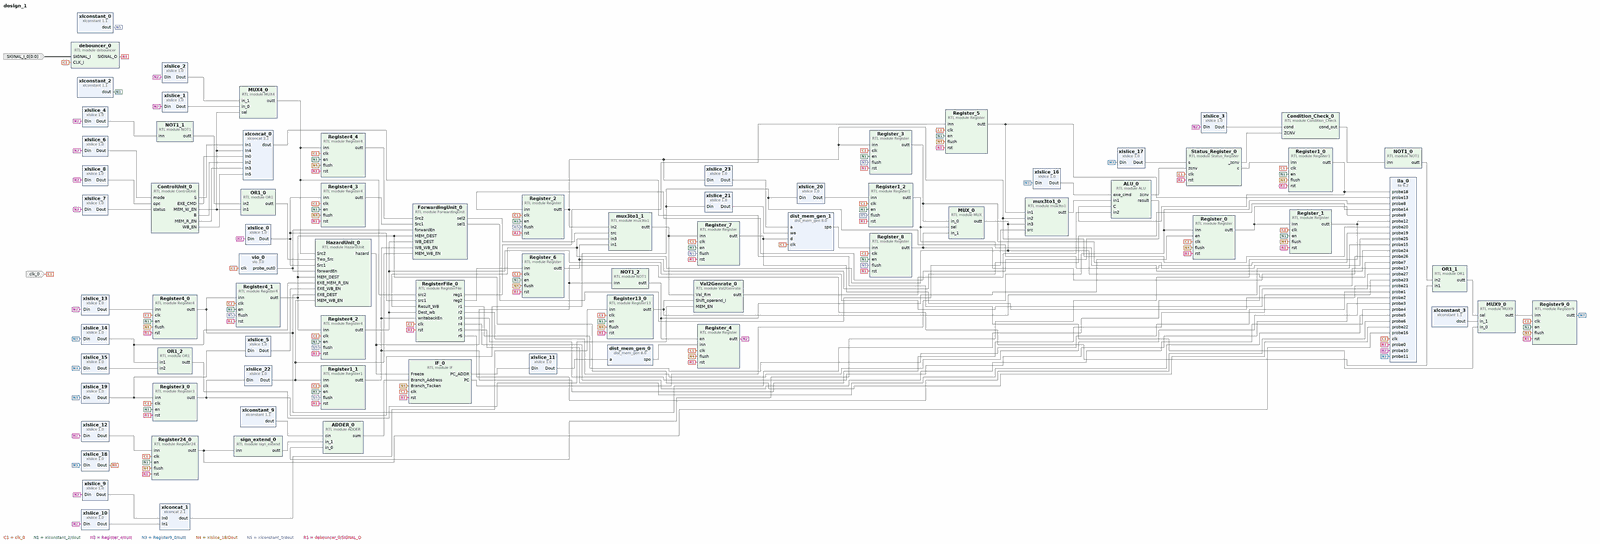
[diagram p0: block diagram of the top level, whole]
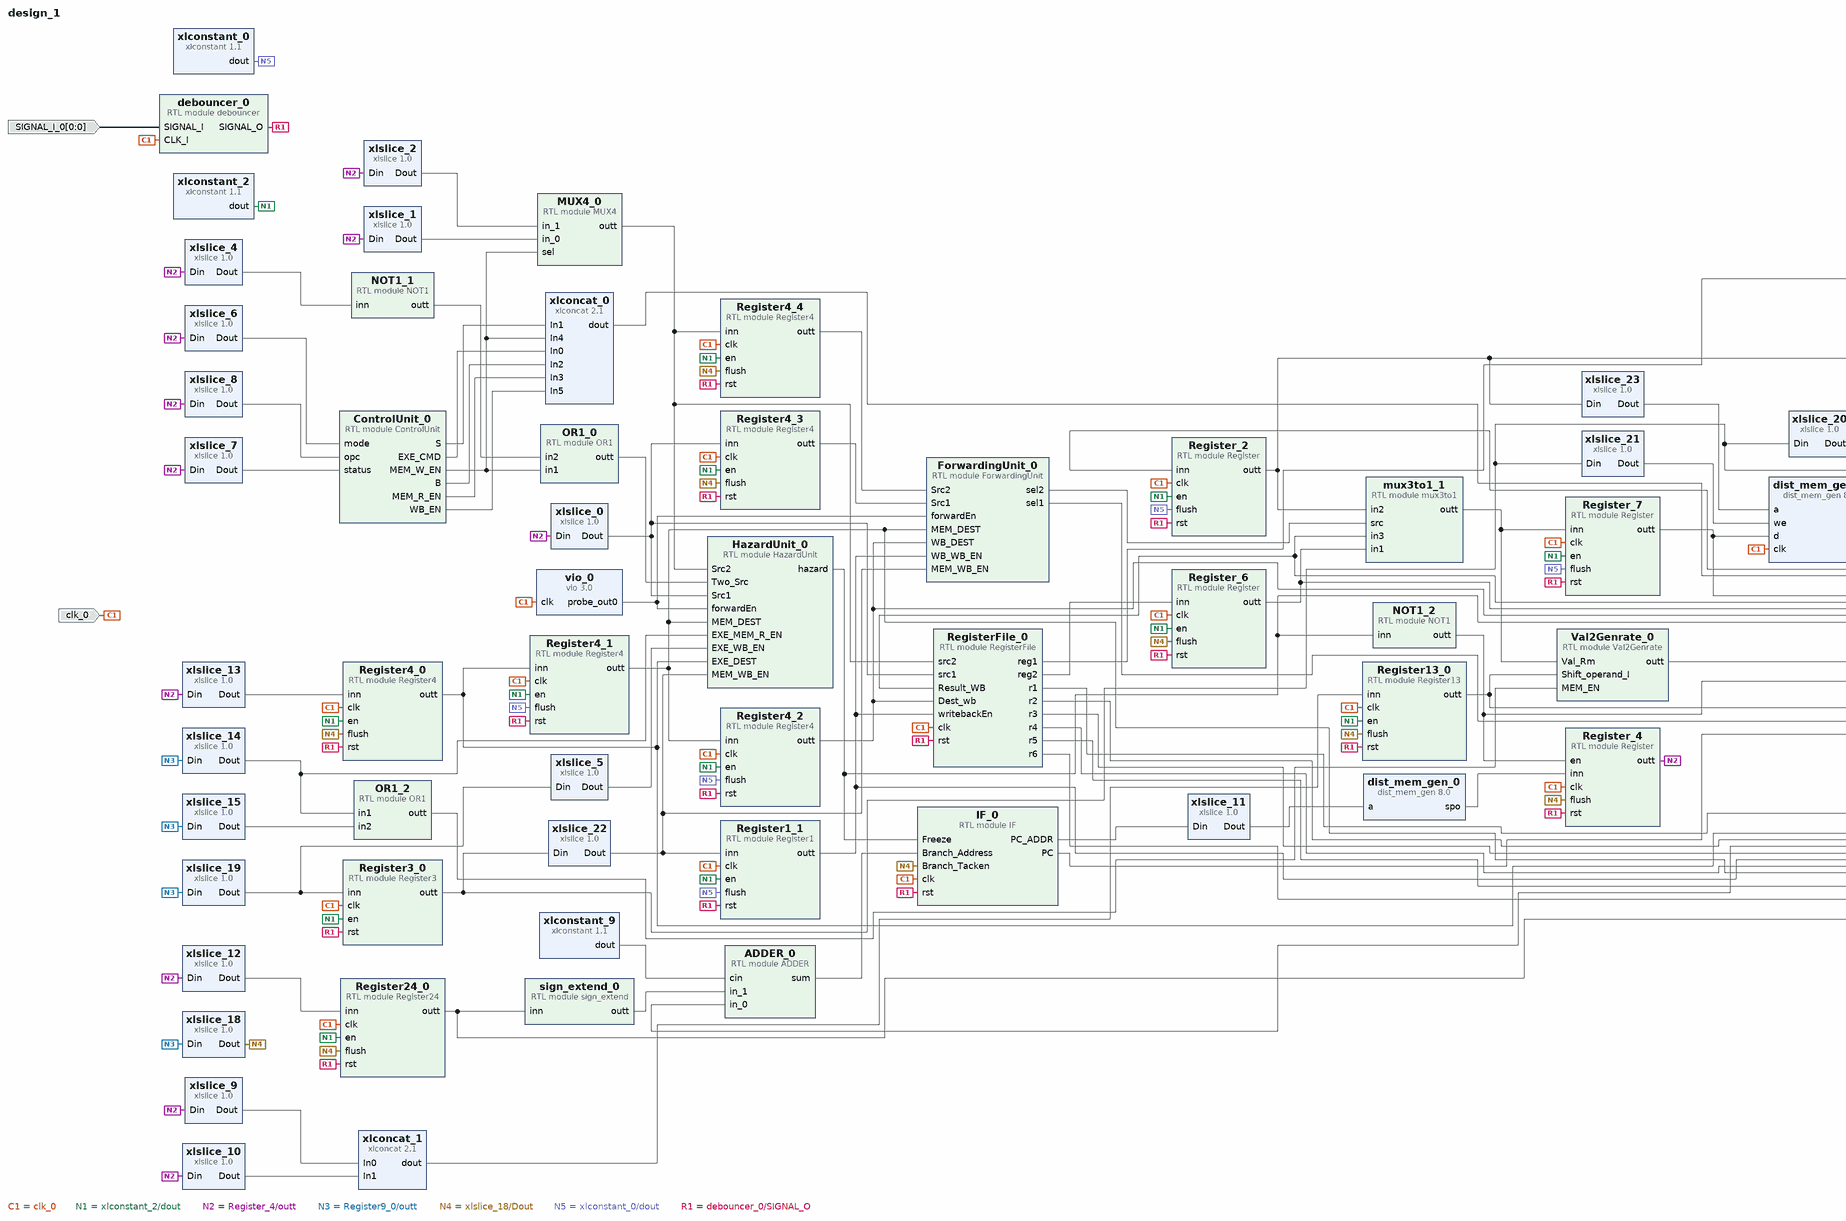
[diagram p1: block diagram of the top level, left part]
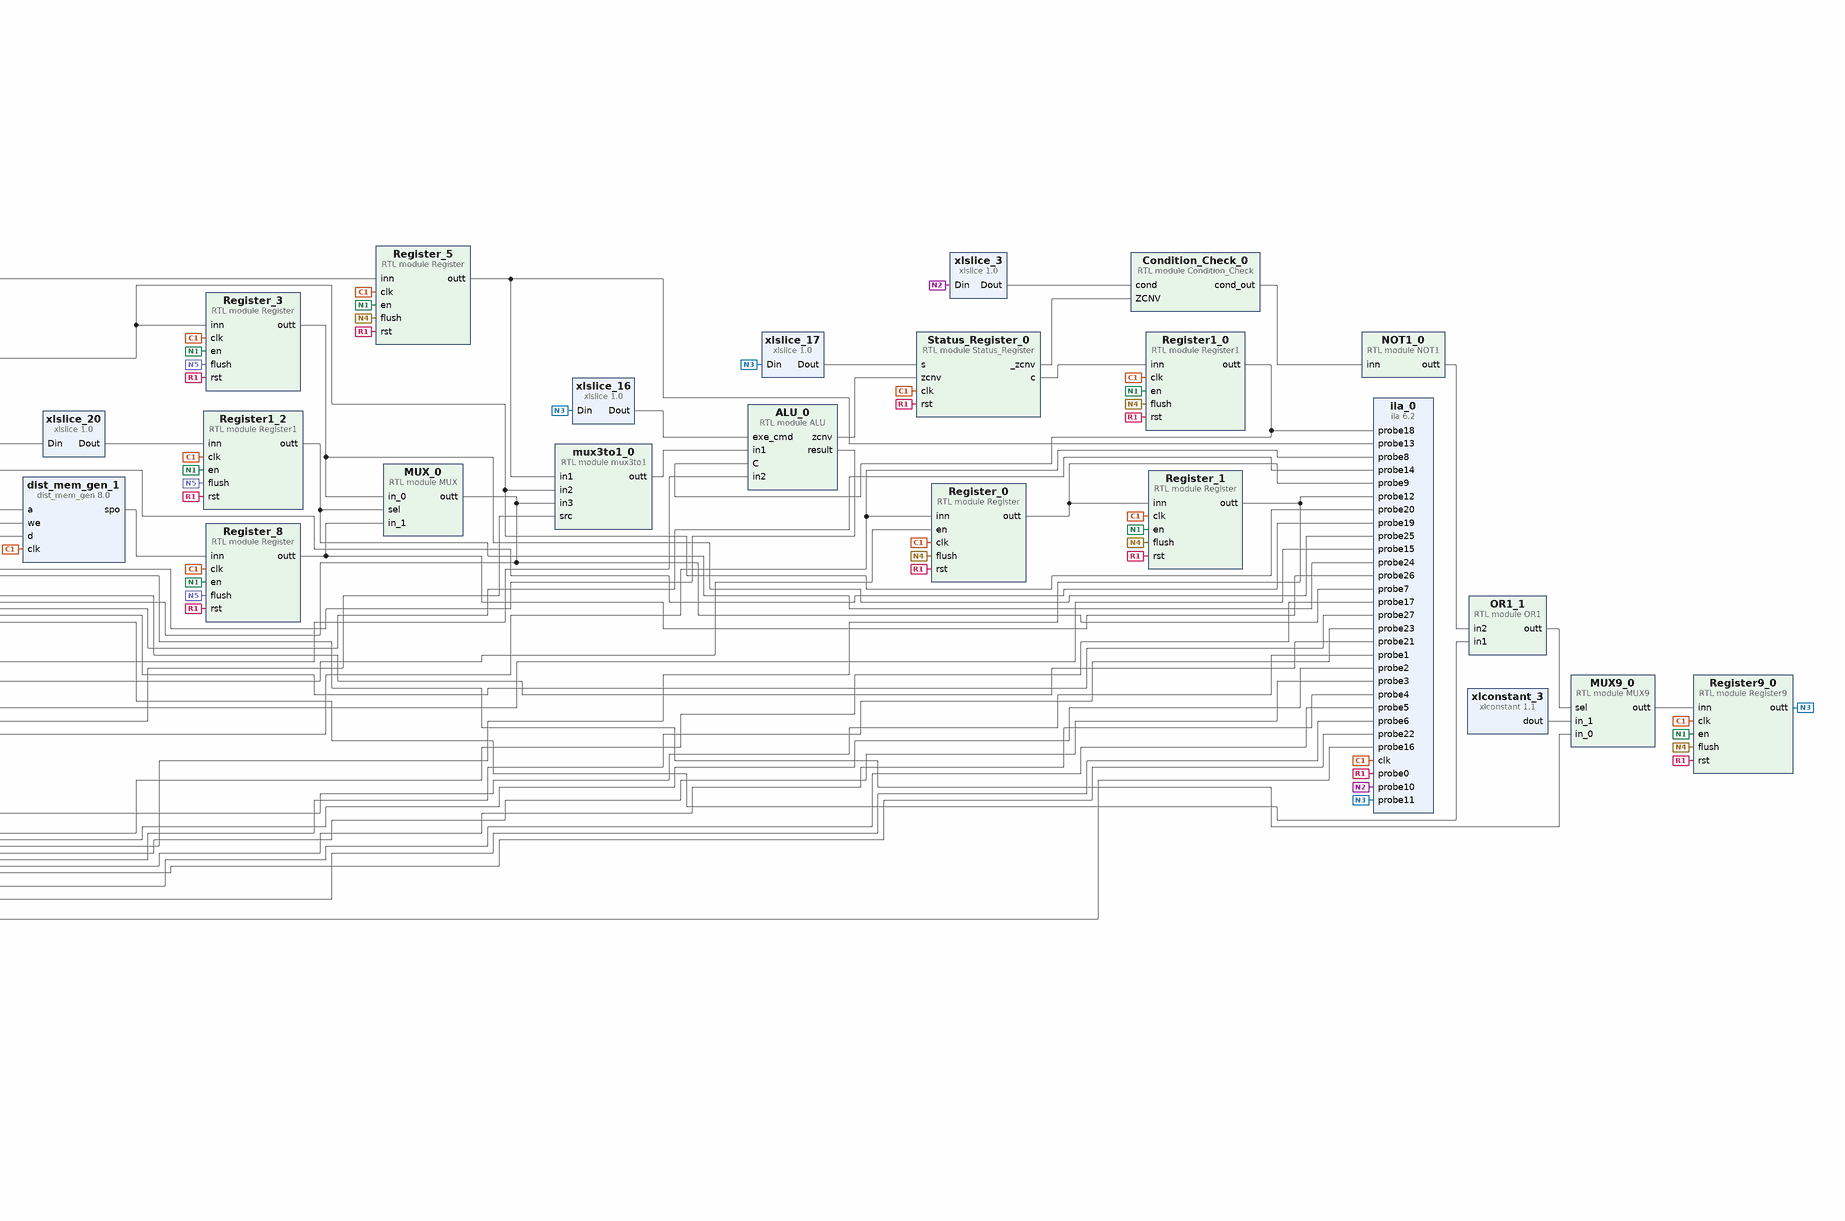
[diagram p2: block diagram of the top level, right part]
# Vivado block design design_1, xc7z010clg400-1, Vivado 2018.3
create_bd_design design_1

create_bd_port -dir I -type clk clk_0
create_bd_port -dir I -from 0 -to 0 SIGNAL_I_0

create_bd_cell -type ip -vlnv xilinx.com:ip:xlconstant:1.1 xlconstant_2
create_bd_cell -type ip -vlnv xilinx.com:ip:ila:6.2 ila_0
set_property -dict [list \
  CONFIG.C_ENABLE_ILA_AXI_MON false \
  CONFIG.C_MONITOR_TYPE Native \
  CONFIG.C_NUM_OF_PROBES 28 \
  CONFIG.C_PROBE0_TYPE 0 \
  CONFIG.C_PROBE0_WIDTH 1 \
  CONFIG.C_PROBE10_TYPE 1 \
  CONFIG.C_PROBE10_WIDTH 32 \
  CONFIG.C_PROBE11_TYPE 1 \
  CONFIG.C_PROBE11_WIDTH 9 \
  CONFIG.C_PROBE12_TYPE 1 \
  CONFIG.C_PROBE12_WIDTH 32 \
  CONFIG.C_PROBE13_TYPE 1 \
  CONFIG.C_PROBE13_WIDTH 32 \
  CONFIG.C_PROBE14_TYPE 1 \
  CONFIG.C_PROBE14_WIDTH 32 \
  CONFIG.C_PROBE15_TYPE 1 \
  CONFIG.C_PROBE15_WIDTH 13 \
  CONFIG.C_PROBE16_TYPE 1 \
  CONFIG.C_PROBE16_WIDTH 24 \
  CONFIG.C_PROBE17_TYPE 1 \
  CONFIG.C_PROBE17_WIDTH 4 \
  CONFIG.C_PROBE18_TYPE 1 \
  CONFIG.C_PROBE19_TYPE 1 \
  CONFIG.C_PROBE19_WIDTH 3 \
  CONFIG.C_PROBE1_TYPE 1 \
  CONFIG.C_PROBE1_WIDTH 32 \
  CONFIG.C_PROBE20_TYPE 1 \
  CONFIG.C_PROBE20_WIDTH 32 \
  CONFIG.C_PROBE21_TYPE 1 \
  CONFIG.C_PROBE21_WIDTH 32 \
  CONFIG.C_PROBE22_TYPE 1 \
  CONFIG.C_PROBE22_WIDTH 4 \
  CONFIG.C_PROBE23_TYPE 1 \
  CONFIG.C_PROBE24_TYPE 1 \
  CONFIG.C_PROBE25_TYPE 1 \
  CONFIG.C_PROBE26_TYPE 1 \
  CONFIG.C_PROBE27_TYPE 1 \
  CONFIG.C_PROBE2_TYPE 1 \
  CONFIG.C_PROBE2_WIDTH 32 \
  CONFIG.C_PROBE3_TYPE 1 \
  CONFIG.C_PROBE3_WIDTH 32 \
  CONFIG.C_PROBE4_TYPE 1 \
  CONFIG.C_PROBE4_WIDTH 32 \
  CONFIG.C_PROBE5_TYPE 1 \
  CONFIG.C_PROBE5_WIDTH 32 \
  CONFIG.C_PROBE6_TYPE 1 \
  CONFIG.C_PROBE6_WIDTH 32 \
  CONFIG.C_PROBE7_TYPE 1 \
  CONFIG.C_PROBE7_WIDTH 32 \
  CONFIG.C_PROBE8_TYPE 1 \
  CONFIG.C_PROBE8_WIDTH 32 \
  CONFIG.C_PROBE9_TYPE 1 \
  CONFIG.C_PROBE9_WIDTH 32 \
] [get_bd_cells ila_0]
create_bd_cell -type ip -vlnv xilinx.com:ip:xlslice:1.0 xlslice_0
set_property -dict {CONFIG.DIN_FROM 19 CONFIG.DIN_TO 16 CONFIG.DOUT_WIDTH 4} [get_bd_cells xlslice_0]
create_bd_cell -type ip -vlnv xilinx.com:ip:xlslice:1.0 xlslice_1
set_property -dict {CONFIG.DIN_FROM 3 CONFIG.DIN_TO 0 CONFIG.DOUT_WIDTH 4} [get_bd_cells xlslice_1]
create_bd_cell -type ip -vlnv xilinx.com:ip:xlslice:1.0 xlslice_2
set_property -dict {CONFIG.DIN_FROM 15 CONFIG.DIN_TO 12 CONFIG.DOUT_WIDTH 4} [get_bd_cells xlslice_2]
create_bd_cell -type ip -vlnv xilinx.com:ip:xlslice:1.0 xlslice_3
set_property -dict {CONFIG.DIN_FROM 31 CONFIG.DIN_TO 28 CONFIG.DOUT_WIDTH 4} [get_bd_cells xlslice_3]
create_bd_cell -type ip -vlnv xilinx.com:ip:xlslice:1.0 xlslice_4
set_property -dict {CONFIG.DIN_FROM 25 CONFIG.DIN_TO 25 CONFIG.DOUT_WIDTH 1} [get_bd_cells xlslice_4]
create_bd_cell -type ip -vlnv xilinx.com:ip:xlconcat:2.1 xlconcat_0
set_property -dict [list \
  CONFIG.IN0_WIDTH 4 \
  CONFIG.IN1_WIDTH 1 \
  CONFIG.IN2_WIDTH 1 \
  CONFIG.IN3_WIDTH 1 \
  CONFIG.IN4_WIDTH 1 \
  CONFIG.IN5_WIDTH 1 \
  CONFIG.NUM_PORTS 6 \
] [get_bd_cells xlconcat_0]
create_bd_cell -type ip -vlnv xilinx.com:ip:xlconstant:1.1 xlconstant_3
set_property -dict {CONFIG.CONST_VAL 0 CONFIG.CONST_WIDTH 9} [get_bd_cells xlconstant_3]
create_bd_cell -type ip -vlnv xilinx.com:ip:xlslice:1.0 xlslice_6
set_property -dict {CONFIG.DIN_FROM 27 CONFIG.DIN_TO 26 CONFIG.DOUT_WIDTH 2} [get_bd_cells xlslice_6]
create_bd_cell -type ip -vlnv xilinx.com:ip:xlslice:1.0 xlslice_7
set_property -dict {CONFIG.DIN_FROM 20 CONFIG.DIN_TO 20 CONFIG.DOUT_WIDTH 1} [get_bd_cells xlslice_7]
create_bd_cell -type ip -vlnv xilinx.com:ip:xlslice:1.0 xlslice_8
set_property -dict {CONFIG.DIN_FROM 24 CONFIG.DIN_TO 21 CONFIG.DOUT_WIDTH 4} [get_bd_cells xlslice_8]
create_bd_cell -type module -reference Condition_Check Condition_Check_0
create_bd_cell -type ip -vlnv xilinx.com:ip:dist_mem_gen:8.0 dist_mem_gen_0
set_property -dict [list \
  CONFIG.coefficient_file ../../../../../../../output_ultimate.coe \
  CONFIG.data_width 32 \
  CONFIG.depth 8192 \
  CONFIG.memory_type rom \
] [get_bd_cells dist_mem_gen_0]
create_bd_cell -type ip -vlnv xilinx.com:ip:xlconcat:2.1 xlconcat_1
set_property -dict {CONFIG.IN0_WIDTH 1 CONFIG.IN1_WIDTH 12} [get_bd_cells xlconcat_1]
create_bd_cell -type ip -vlnv xilinx.com:ip:xlslice:1.0 xlslice_9
set_property -dict {CONFIG.DIN_FROM 25 CONFIG.DIN_TO 25 CONFIG.DOUT_WIDTH 1} [get_bd_cells xlslice_9]
create_bd_cell -type ip -vlnv xilinx.com:ip:xlslice:1.0 xlslice_10
set_property -dict {CONFIG.DIN_FROM 11 CONFIG.DOUT_WIDTH 12} [get_bd_cells xlslice_10]
create_bd_cell -type ip -vlnv xilinx.com:ip:xlslice:1.0 xlslice_12
set_property -dict {CONFIG.DIN_FROM 23 CONFIG.DOUT_WIDTH 24} [get_bd_cells xlslice_12]
create_bd_cell -type ip -vlnv xilinx.com:ip:xlslice:1.0 xlslice_13
set_property -dict {CONFIG.DIN_FROM 15 CONFIG.DIN_TO 12 CONFIG.DOUT_WIDTH 4} [get_bd_cells xlslice_13]
create_bd_cell -type ip -vlnv xilinx.com:ip:xlslice:1.0 xlslice_14
set_property -dict {CONFIG.DIN_FROM 6 CONFIG.DIN_TO 6 CONFIG.DIN_WIDTH 9 CONFIG.DOUT_WIDTH 1} [get_bd_cells xlslice_14]
create_bd_cell -type ip -vlnv xilinx.com:ip:xlslice:1.0 xlslice_15
set_property -dict {CONFIG.DIN_FROM 7 CONFIG.DIN_TO 7 CONFIG.DIN_WIDTH 9 CONFIG.DOUT_WIDTH 1} [get_bd_cells xlslice_15]
create_bd_cell -type ip -vlnv xilinx.com:ip:xlslice:1.0 xlslice_16
set_property -dict {CONFIG.DIN_FROM 3 CONFIG.DIN_TO 0 CONFIG.DIN_WIDTH 9 CONFIG.DOUT_WIDTH 4} [get_bd_cells xlslice_16]
create_bd_cell -type module -reference ADDER ADDER_0
create_bd_cell -type ip -vlnv xilinx.com:ip:xlconstant:1.1 xlconstant_9
set_property -dict {CONFIG.CONST_VAL 0} [get_bd_cells xlconstant_9]
create_bd_cell -type ip -vlnv xilinx.com:ip:xlslice:1.0 xlslice_17
set_property -dict {CONFIG.DIN_FROM 4 CONFIG.DIN_TO 4 CONFIG.DIN_WIDTH 9 CONFIG.DOUT_WIDTH 1} [get_bd_cells xlslice_17]
create_bd_cell -type ip -vlnv xilinx.com:ip:xlslice:1.0 xlslice_18
set_property -dict {CONFIG.DIN_FROM 5 CONFIG.DIN_TO 5 CONFIG.DIN_WIDTH 9 CONFIG.DOUT_WIDTH 1} [get_bd_cells xlslice_18]
create_bd_cell -type ip -vlnv xilinx.com:ip:xlslice:1.0 xlslice_19
set_property -dict {CONFIG.DIN_FROM 8 CONFIG.DIN_TO 6 CONFIG.DIN_WIDTH 9 CONFIG.DOUT_WIDTH 3} [get_bd_cells xlslice_19]
create_bd_cell -type ip -vlnv xilinx.com:ip:xlconstant:1.1 xlconstant_0
set_property -dict {CONFIG.CONST_VAL 0} [get_bd_cells xlconstant_0]
create_bd_cell -type module -reference debouncer debouncer_0
create_bd_cell -type ip -vlnv xilinx.com:ip:dist_mem_gen:8.0 dist_mem_gen_1
set_property -dict {CONFIG.data_width 32 CONFIG.depth 1024} [get_bd_cells dist_mem_gen_1]
create_bd_cell -type ip -vlnv xilinx.com:ip:xlslice:1.0 xlslice_20
set_property -dict {CONFIG.DIN_FROM 0 CONFIG.DIN_TO 0 CONFIG.DIN_WIDTH 3} [get_bd_cells xlslice_20]
create_bd_cell -type ip -vlnv xilinx.com:ip:xlslice:1.0 xlslice_21
set_property -dict {CONFIG.DIN_FROM 1 CONFIG.DIN_TO 1 CONFIG.DIN_WIDTH 3 CONFIG.DOUT_WIDTH 1} [get_bd_cells xlslice_21]
create_bd_cell -type ip -vlnv xilinx.com:ip:xlslice:1.0 xlslice_22
set_property -dict {CONFIG.DIN_FROM 2 CONFIG.DIN_TO 2 CONFIG.DIN_WIDTH 3 CONFIG.DOUT_WIDTH 1} [get_bd_cells xlslice_22]
create_bd_cell -type ip -vlnv xilinx.com:ip:xlslice:1.0 xlslice_23
set_property -dict {CONFIG.DIN_FROM 9 CONFIG.DOUT_WIDTH 10} [get_bd_cells xlslice_23]
create_bd_cell -type ip -vlnv xilinx.com:ip:xlslice:1.0 xlslice_5
set_property -dict {CONFIG.DIN_FROM 2 CONFIG.DIN_TO 2 CONFIG.DIN_WIDTH 3} [get_bd_cells xlslice_5]
create_bd_cell -type module -reference ALU ALU_0
create_bd_cell -type module -reference Register Register_0
create_bd_cell -type module -reference Register Register_1
create_bd_cell -type module -reference Register Register_4
create_bd_cell -type module -reference Register Register_5
create_bd_cell -type module -reference Register Register_6
create_bd_cell -type module -reference Register Register_2
create_bd_cell -type module -reference Register Register_7
create_bd_cell -type module -reference Register Register_3
create_bd_cell -type module -reference Register Register_8
create_bd_cell -type module -reference NOT1 NOT1_0
create_bd_cell -type module -reference NOT1 NOT1_1
create_bd_cell -type module -reference NOT1 NOT1_2
create_bd_cell -type module -reference OR1 OR1_0
create_bd_cell -type module -reference OR1 OR1_1
create_bd_cell -type module -reference OR1 OR1_2
create_bd_cell -type module -reference MUX9 MUX9_0
create_bd_cell -type module -reference MUX MUX_0
create_bd_cell -type module -reference MUX4 MUX4_0
create_bd_cell -type module -reference Register9 Register9_0
create_bd_cell -type module -reference Register13 Register13_0
create_bd_cell -type module -reference Register24 Register24_0
create_bd_cell -type module -reference Register4 Register4_0
create_bd_cell -type module -reference Register4 Register4_1
create_bd_cell -type module -reference Register4 Register4_2
create_bd_cell -type module -reference Val2Genrate Val2Genrate_0
create_bd_cell -type module -reference sign_extend sign_extend_0
create_bd_cell -type module -reference Register1 Register1_0
create_bd_cell -type module -reference Register1 Register1_1
create_bd_cell -type module -reference Register1 Register1_2
create_bd_cell -type module -reference Register3 Register3_0
create_bd_cell -type ip -vlnv xilinx.com:ip:xlslice:1.0 xlslice_11
set_property -dict {CONFIG.DIN_FROM 12 CONFIG.DOUT_WIDTH 13} [get_bd_cells xlslice_11]
create_bd_cell -type module -reference ControlUnit ControlUnit_0
create_bd_cell -type module -reference RegisterFile RegisterFile_0
create_bd_cell -type module -reference HazardUnit HazardUnit_0
create_bd_cell -type module -reference Register4 Register4_3
create_bd_cell -type module -reference Register4 Register4_4
create_bd_cell -type module -reference mux3to1 mux3to1_0
create_bd_cell -type module -reference mux3to1 mux3to1_1
create_bd_cell -type module -reference ForwardingUnit ForwardingUnit_0
create_bd_cell -type module -reference IF IF_0
create_bd_cell -type module -reference Status_Register Status_Register_0
create_bd_cell -type ip -vlnv xilinx.com:ip:vio:3.0 vio_0
set_property -dict {CONFIG.C_NUM_PROBE_IN 0} [get_bd_cells vio_0]

# ---- connections ----

connect_bd_net -net clk_0_1 [get_bd_ports clk_0] \
  [get_bd_pins ila_0/clk] [get_bd_pins dist_mem_gen_1/clk] [get_bd_pins debouncer_0/CLK_I] [get_bd_pins Register_0/clk] \
  [get_bd_pins Register_1/clk] [get_bd_pins Register_4/clk] [get_bd_pins Register_5/clk] [get_bd_pins Register_6/clk] \
  [get_bd_pins Register_2/clk] [get_bd_pins Register_7/clk] [get_bd_pins Register_3/clk] [get_bd_pins Register_8/clk] \
  [get_bd_pins Register9_0/clk] [get_bd_pins Register13_0/clk] [get_bd_pins Register24_0/clk] [get_bd_pins Register4_0/clk] \
  [get_bd_pins Register4_1/clk] [get_bd_pins Register4_2/clk] [get_bd_pins Register1_0/clk] [get_bd_pins Register1_1/clk] \
  [get_bd_pins Register1_2/clk] [get_bd_pins Register3_0/clk] [get_bd_pins RegisterFile_0/clk] [get_bd_pins Register4_3/clk] \
  [get_bd_pins Register4_4/clk] [get_bd_pins IF_0/clk] [get_bd_pins Status_Register_0/clk] [get_bd_pins vio_0/clk]
connect_bd_net [get_bd_pins IF_0/PC] [get_bd_pins Register_0/inn] [get_bd_pins ila_0/probe8]
connect_bd_net -net Register_1_out [get_bd_pins Register_1/outt] [get_bd_pins ADDER_0/in_0] [get_bd_pins ila_0/probe12]
connect_bd_net [get_bd_pins xlconstant_2/dout] \
  [get_bd_pins Register_1/en] [get_bd_pins Register_5/en] [get_bd_pins Register_6/en] [get_bd_pins Register_2/en] \
  [get_bd_pins Register_7/en] [get_bd_pins Register_3/en] [get_bd_pins Register_8/en] [get_bd_pins Register9_0/en] \
  [get_bd_pins Register13_0/en] [get_bd_pins Register24_0/en] [get_bd_pins Register4_0/en] [get_bd_pins Register4_1/en] \
  [get_bd_pins Register4_2/en] [get_bd_pins Register1_0/en] [get_bd_pins Register1_1/en] [get_bd_pins Register1_2/en] \
  [get_bd_pins Register3_0/en] [get_bd_pins Register4_3/en] [get_bd_pins Register4_4/en]
connect_bd_net [get_bd_pins xlslice_2/Dout] [get_bd_pins MUX4_0/in_1]
connect_bd_net [get_bd_pins xlslice_1/Dout] [get_bd_pins MUX4_0/in_0]
connect_bd_net [get_bd_pins xlslice_0/Dout] [get_bd_pins RegisterFile_0/src1] [get_bd_pins HazardUnit_0/Src1] [get_bd_pins Register4_3/inn]
connect_bd_net [get_bd_pins RegisterFile_0/reg1] [get_bd_pins Register_5/inn]
connect_bd_net [get_bd_pins RegisterFile_0/reg2] [get_bd_pins Register_6/inn]
connect_bd_net -net Register_4_out [get_bd_pins Register_4/outt] \
  [get_bd_pins xlslice_0/Din] [get_bd_pins xlslice_1/Din] [get_bd_pins xlslice_2/Din] [get_bd_pins xlslice_4/Din] \
  [get_bd_pins xlslice_3/Din] [get_bd_pins xlslice_6/Din] [get_bd_pins xlslice_8/Din] [get_bd_pins xlslice_7/Din] \
  [get_bd_pins xlslice_9/Din] [get_bd_pins xlslice_10/Din] [get_bd_pins xlslice_12/Din] [get_bd_pins xlslice_13/Din] \
  [get_bd_pins ila_0/probe10]
connect_bd_net [get_bd_pins ControlUnit_0/S] [get_bd_pins xlconcat_0/In1]
connect_bd_net [get_bd_pins ControlUnit_0/EXE_CMD] [get_bd_pins xlconcat_0/In0]
connect_bd_net [get_bd_pins ControlUnit_0/B] [get_bd_pins xlconcat_0/In2]
connect_bd_net [get_bd_pins ControlUnit_0/MEM_R_EN] [get_bd_pins xlconcat_0/In3]
connect_bd_net [get_bd_pins ControlUnit_0/MEM_W_EN] [get_bd_pins xlconcat_0/In4] [get_bd_pins OR1_0/in1] [get_bd_pins MUX4_0/sel]
connect_bd_net [get_bd_pins ControlUnit_0/WB_EN] [get_bd_pins xlconcat_0/In5]
connect_bd_net [get_bd_pins xlconcat_0/dout] [get_bd_pins MUX9_0/in_0]
connect_bd_net [get_bd_pins xlconstant_3/dout] [get_bd_pins MUX9_0/in_1]
connect_bd_net -net OR1_1_out [get_bd_pins OR1_1/outt] [get_bd_pins MUX9_0/sel]
connect_bd_net -net NOT1_0_out [get_bd_pins NOT1_0/outt] [get_bd_pins OR1_1/in2]
connect_bd_net [get_bd_pins xlslice_4/Dout] [get_bd_pins NOT1_1/inn]
connect_bd_net -net NOT1_1_out [get_bd_pins NOT1_1/outt] [get_bd_pins OR1_0/in2]
connect_bd_net [get_bd_pins xlslice_6/Dout] [get_bd_pins ControlUnit_0/mode]
connect_bd_net [get_bd_pins xlslice_8/Dout] [get_bd_pins ControlUnit_0/opc]
connect_bd_net [get_bd_pins xlslice_7/Dout] [get_bd_pins ControlUnit_0/status]
connect_bd_net [get_bd_pins xlslice_3/Dout] [get_bd_pins Condition_Check_0/cond]
connect_bd_net [get_bd_pins Condition_Check_0/cond_out] [get_bd_pins NOT1_0/inn]
connect_bd_net [get_bd_pins dist_mem_gen_0/spo] [get_bd_pins Register_4/inn]
connect_bd_net [get_bd_pins xlconcat_1/dout] [get_bd_pins Register13_0/inn]
connect_bd_net [get_bd_pins xlslice_9/Dout] [get_bd_pins xlconcat_1/In0]
connect_bd_net [get_bd_pins xlslice_10/Dout] [get_bd_pins xlconcat_1/In1]
connect_bd_net [get_bd_pins xlslice_12/Dout] [get_bd_pins Register24_0/inn]
connect_bd_net [get_bd_pins xlslice_13/Dout] [get_bd_pins Register4_0/inn]
connect_bd_net -net Register9_0_out [get_bd_pins Register9_0/outt] \
  [get_bd_pins xlslice_14/Din] [get_bd_pins xlslice_15/Din] [get_bd_pins xlslice_16/Din] [get_bd_pins xlslice_17/Din] \
  [get_bd_pins xlslice_18/Din] [get_bd_pins xlslice_19/Din] [get_bd_pins ila_0/probe11]
connect_bd_net [get_bd_pins xlslice_14/Dout] [get_bd_pins OR1_2/in1] [get_bd_pins HazardUnit_0/EXE_MEM_R_EN]
connect_bd_net [get_bd_pins xlslice_15/Dout] [get_bd_pins OR1_2/in2]
connect_bd_net -net Register_6_out [get_bd_pins Register_6/outt] [get_bd_pins ila_0/probe14] [get_bd_pins mux3to1_1/in1]
connect_bd_net -net Register13_0_out [get_bd_pins Register13_0/outt] [get_bd_pins Val2Genrate_0/Shift_operand_I] [get_bd_pins ila_0/probe15]
connect_bd_net -net OR1_2_out [get_bd_pins OR1_2/outt] [get_bd_pins Val2Genrate_0/MEM_EN]
connect_bd_net -net sign_extend_0_out [get_bd_pins sign_extend_0/outt] [get_bd_pins ADDER_0/in_1]
connect_bd_net [get_bd_pins xlconstant_9/dout] [get_bd_pins ADDER_0/cin]
connect_bd_net [get_bd_pins Status_Register_0/_zcnv] [get_bd_pins Condition_Check_0/ZCNV]
connect_bd_net [get_bd_pins xlslice_17/Dout] [get_bd_pins Status_Register_0/s]
connect_bd_net [get_bd_pins ADDER_0/sum] [get_bd_pins IF_0/Branch_Address]
connect_bd_net [get_bd_pins xlslice_18/Dout] \
  [get_bd_pins Register_0/flush] [get_bd_pins Register_1/flush] [get_bd_pins Register_4/flush] [get_bd_pins Register_5/flush] \
  [get_bd_pins Register_6/flush] [get_bd_pins Register9_0/flush] [get_bd_pins Register13_0/flush] \
  [get_bd_pins Register24_0/flush] [get_bd_pins Register4_0/flush] [get_bd_pins Register1_0/flush] \
  [get_bd_pins Register4_3/flush] [get_bd_pins Register4_4/flush] [get_bd_pins IF_0/Branch_Tacken]
connect_bd_net -net Register_5_out [get_bd_pins Register_5/outt] [get_bd_pins ila_0/probe13] [get_bd_pins mux3to1_0/in1]
connect_bd_net -net Val2Genrate_0_out [get_bd_pins Val2Genrate_0/outt] [get_bd_pins ALU_0/in2]
connect_bd_net [get_bd_pins xlslice_16/Dout] [get_bd_pins ALU_0/exe_cmd]
connect_bd_net [get_bd_pins Status_Register_0/c] [get_bd_pins Register1_0/inn]
connect_bd_net -net Register1_0_out [get_bd_pins Register1_0/outt] [get_bd_pins ALU_0/C] [get_bd_pins ila_0/probe18]
connect_bd_net [get_bd_pins xlslice_19/Dout] [get_bd_pins xlslice_5/Din] [get_bd_pins Register3_0/inn]
connect_bd_net -net Register4_0_out [get_bd_pins Register4_0/outt] \
  [get_bd_pins Register4_1/inn] [get_bd_pins ila_0/probe17] [get_bd_pins HazardUnit_0/EXE_DEST]
connect_bd_net [get_bd_pins ALU_0/result] [get_bd_pins Register_2/inn]
connect_bd_net [get_bd_pins ALU_0/zcnv] [get_bd_pins Status_Register_0/zcnv]
connect_bd_net [get_bd_pins xlconstant_0/dout] \
  [get_bd_pins Register_2/flush] [get_bd_pins Register_7/flush] [get_bd_pins Register_3/flush] [get_bd_pins Register_8/flush] \
  [get_bd_pins Register4_1/flush] [get_bd_pins Register4_2/flush] [get_bd_pins Register1_1/flush] \
  [get_bd_pins Register1_2/flush]
connect_bd_net -net Register_2_out [get_bd_pins Register_2/outt] \
  [get_bd_pins xlslice_23/Din] [get_bd_pins Register_3/inn] [get_bd_pins ila_0/probe20] [get_bd_pins mux3to1_0/in2] \
  [get_bd_pins mux3to1_1/in2]
connect_bd_net -net Register3_0_out [get_bd_pins Register3_0/outt] \
  [get_bd_pins xlslice_20/Din] [get_bd_pins xlslice_21/Din] [get_bd_pins xlslice_22/Din] [get_bd_pins ila_0/probe19]
connect_bd_net [get_bd_pins xlslice_22/Dout] \
  [get_bd_pins Register1_1/inn] [get_bd_pins HazardUnit_0/MEM_WB_EN] [get_bd_pins ForwardingUnit_0/MEM_WB_EN]
connect_bd_net [get_bd_pins xlslice_20/Dout] [get_bd_pins Register1_2/inn]
connect_bd_net [get_bd_pins dist_mem_gen_1/spo] [get_bd_pins Register_8/inn]
connect_bd_net -net Register_3_out [get_bd_pins Register_3/outt] [get_bd_pins MUX_0/in_0] [get_bd_pins ila_0/probe25]
connect_bd_net -net Register_8_out [get_bd_pins Register_8/outt] [get_bd_pins MUX_0/in_1] [get_bd_pins ila_0/probe26]
connect_bd_net -net Register1_2_out [get_bd_pins Register1_2/outt] [get_bd_pins MUX_0/sel] [get_bd_pins ila_0/probe24]
connect_bd_net -net Register4_2_out [get_bd_pins Register4_2/outt] \
  [get_bd_pins ila_0/probe27] [get_bd_pins RegisterFile_0/Dest_wb] [get_bd_pins ForwardingUnit_0/WB_DEST]
connect_bd_net -net MUX_0_out [get_bd_pins MUX_0/outt] \
  [get_bd_pins ila_0/probe7] [get_bd_pins RegisterFile_0/Result_WB] [get_bd_pins mux3to1_0/in3] [get_bd_pins mux3to1_1/in3]
connect_bd_net -net Register1_1_out [get_bd_pins Register1_1/outt] \
  [get_bd_pins ila_0/probe23] [get_bd_pins RegisterFile_0/writebackEn] [get_bd_pins ForwardingUnit_0/WB_WB_EN]
connect_bd_net [get_bd_pins xlslice_23/Dout] [get_bd_pins dist_mem_gen_1/a]
connect_bd_net -net Register_7_out [get_bd_pins Register_7/outt] [get_bd_pins dist_mem_gen_1/d] [get_bd_pins ila_0/probe21]
connect_bd_net [get_bd_pins xlslice_21/Dout] [get_bd_pins dist_mem_gen_1/we]
connect_bd_net -net OR1_0_out [get_bd_pins OR1_0/outt] [get_bd_pins HazardUnit_0/Two_Src]
connect_bd_net [get_bd_pins xlslice_5/Dout] [get_bd_pins HazardUnit_0/EXE_WB_EN]
connect_bd_net [get_bd_pins HazardUnit_0/hazard] [get_bd_pins OR1_1/in1] [get_bd_pins NOT1_2/inn] [get_bd_pins IF_0/Freeze]
connect_bd_net -net NOT1_2_out [get_bd_pins NOT1_2/outt] [get_bd_pins Register_0/en] [get_bd_pins Register_4/en]
connect_bd_net [get_bd_pins RegisterFile_0/r1] [get_bd_pins ila_0/probe1]
connect_bd_net [get_bd_pins RegisterFile_0/r2] [get_bd_pins ila_0/probe2]
connect_bd_net [get_bd_pins RegisterFile_0/r3] [get_bd_pins ila_0/probe3]
connect_bd_net [get_bd_pins RegisterFile_0/r4] [get_bd_pins ila_0/probe4]
connect_bd_net [get_bd_pins RegisterFile_0/r5] [get_bd_pins ila_0/probe5]
connect_bd_net [get_bd_pins RegisterFile_0/r6] [get_bd_pins ila_0/probe6]
connect_bd_net -net SIGNAL_I_0_2 [get_bd_pins debouncer_0/SIGNAL_O] \
  [get_bd_pins Register_0/rst] [get_bd_pins Register_1/rst] [get_bd_pins Register_4/rst] [get_bd_pins Register_5/rst] \
  [get_bd_pins Register_6/rst] [get_bd_pins Register_2/rst] [get_bd_pins Register_7/rst] [get_bd_pins Register_3/rst] \
  [get_bd_pins Register_8/rst] [get_bd_pins Register9_0/rst] [get_bd_pins Register13_0/rst] [get_bd_pins Register24_0/rst] \
  [get_bd_pins Register4_0/rst] [get_bd_pins Register4_1/rst] [get_bd_pins Register4_2/rst] [get_bd_pins Register1_0/rst] \
  [get_bd_pins Register1_1/rst] [get_bd_pins Register1_2/rst] [get_bd_pins Register3_0/rst] [get_bd_pins ila_0/probe0] \
  [get_bd_pins RegisterFile_0/rst] [get_bd_pins Register4_3/rst] [get_bd_pins Register4_4/rst] [get_bd_pins IF_0/rst] \
  [get_bd_pins Status_Register_0/rst]
connect_bd_net -net Register4_1_out [get_bd_pins Register4_1/outt] \
  [get_bd_pins Register4_2/inn] [get_bd_pins ila_0/probe22] [get_bd_pins HazardUnit_0/MEM_DEST] \
  [get_bd_pins ForwardingUnit_0/MEM_DEST]
connect_bd_net -net MUX4_0_out [get_bd_pins MUX4_0/outt] \
  [get_bd_pins RegisterFile_0/src2] [get_bd_pins HazardUnit_0/Src2] [get_bd_pins Register4_4/inn]
connect_bd_net [get_bd_pins MUX9_0/outt] [get_bd_pins Register9_0/inn]
connect_bd_net [get_bd_pins Register_0/outt] [get_bd_pins Register_1/inn] [get_bd_pins ila_0/probe9]
connect_bd_net [get_bd_pins Register24_0/outt] [get_bd_pins sign_extend_0/inn] [get_bd_pins ila_0/probe16]
connect_bd_net [get_bd_pins IF_0/PC_ADDR] [get_bd_pins xlslice_11/Din]
connect_bd_net [get_bd_pins xlslice_11/Dout] [get_bd_pins dist_mem_gen_0/a]
connect_bd_net [get_bd_pins Register4_3/outt] [get_bd_pins ForwardingUnit_0/Src1]
connect_bd_net [get_bd_pins Register4_4/outt] [get_bd_pins ForwardingUnit_0/Src2]
connect_bd_net [get_bd_pins ForwardingUnit_0/sel1] [get_bd_pins mux3to1_0/src]
connect_bd_net [get_bd_pins mux3to1_0/outt] [get_bd_pins ALU_0/in1]
connect_bd_net [get_bd_pins ForwardingUnit_0/sel2] [get_bd_pins mux3to1_1/src]
connect_bd_net [get_bd_pins mux3to1_1/outt] [get_bd_pins Val2Genrate_0/Val_Rm] [get_bd_pins Register_7/inn]
connect_bd_net -net xlconstant_1_dout [get_bd_pins vio_0/probe_out0] [get_bd_pins HazardUnit_0/forwardEn] [get_bd_pins ForwardingUnit_0/forwardEn]
connect_bd_net -net SIGNAL_I_0_1 [get_bd_ports SIGNAL_I_0] [get_bd_pins debouncer_0/SIGNAL_I]

validate_bd_design
save_bd_design
